# EAGLE design light detector v2.3 (EAGLE 9.5.1)
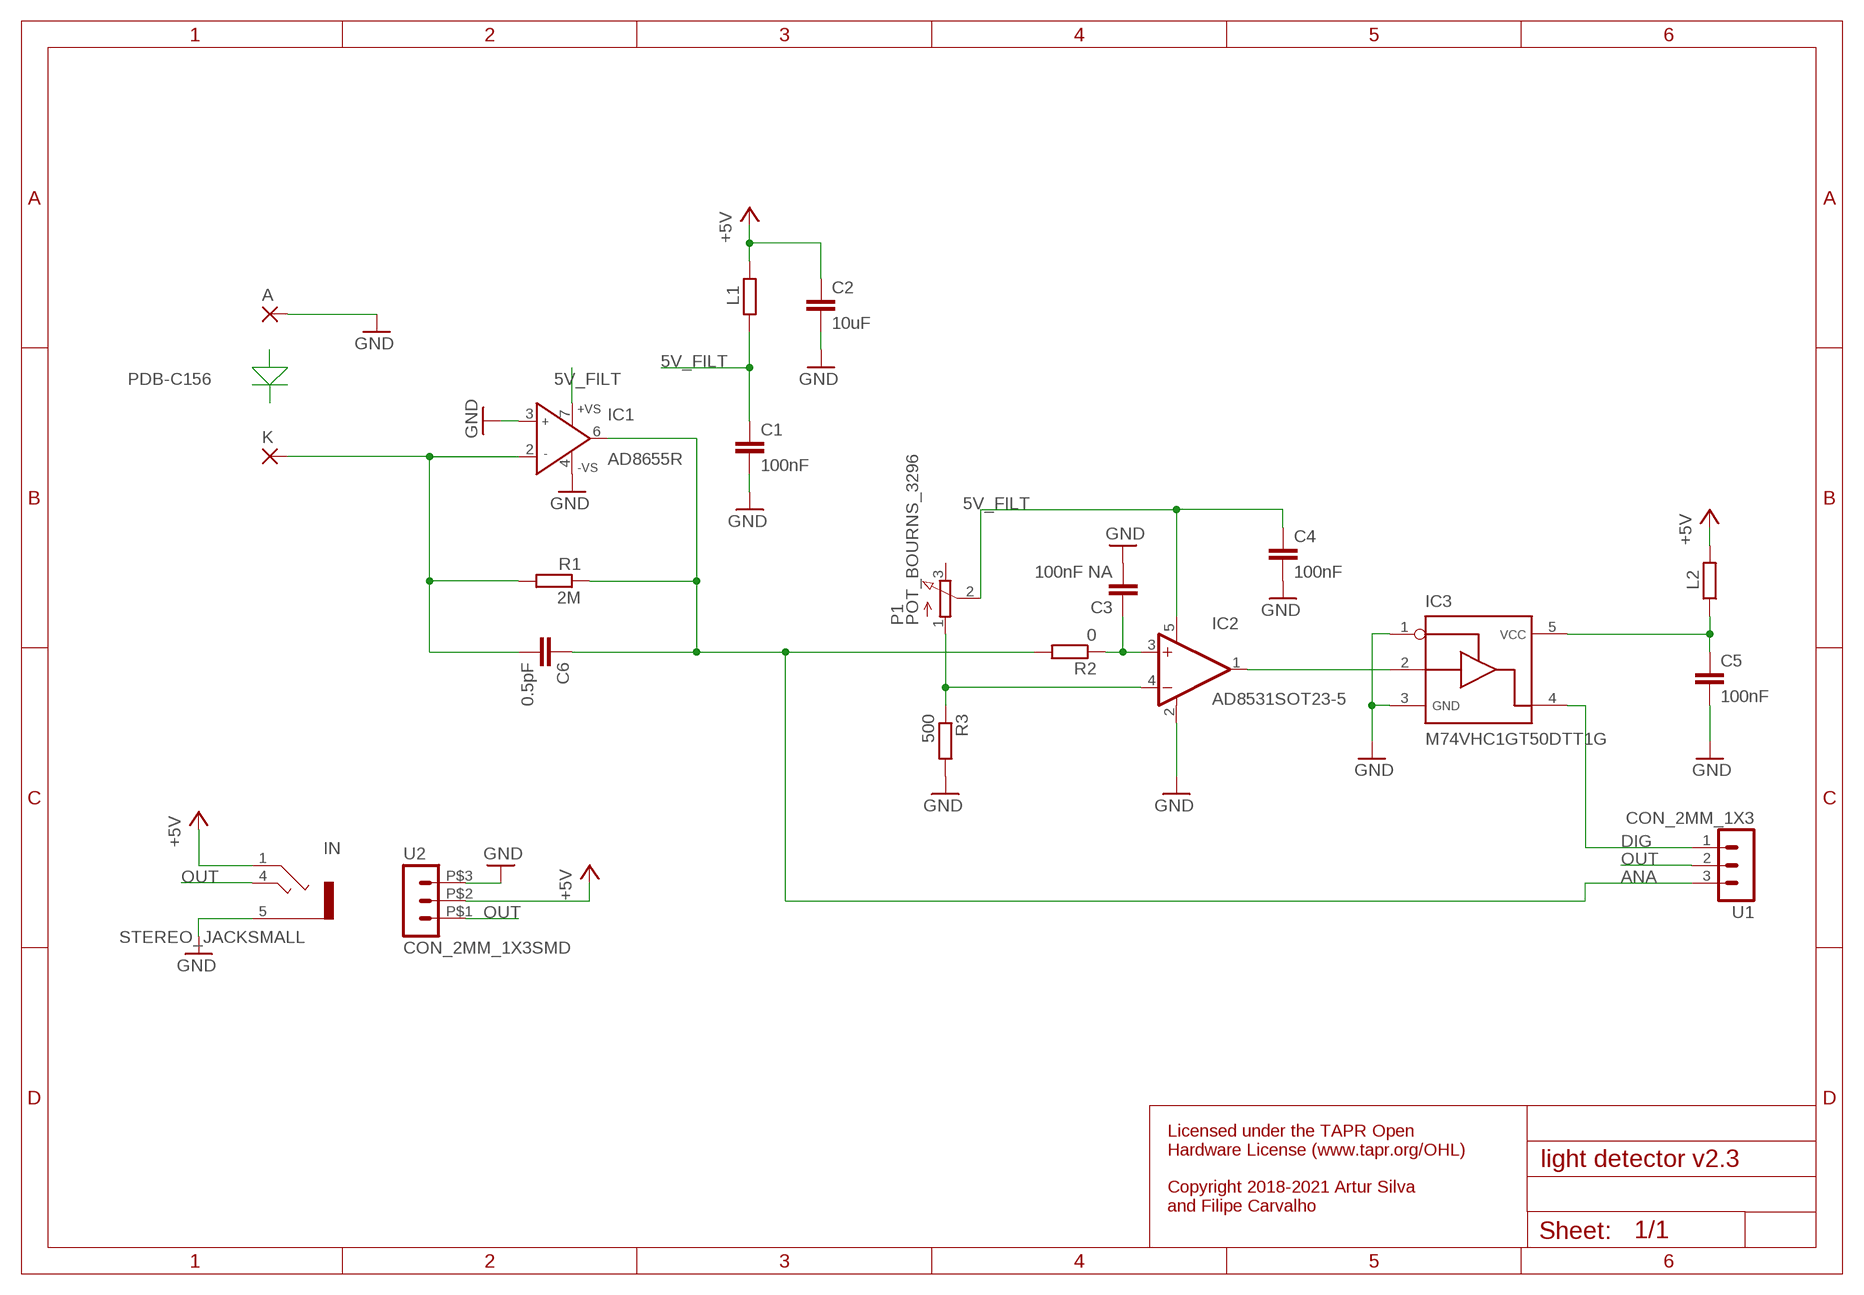
[diagram p0: schematic, sheet 1]

## Parts
A  1,6/0,8  [1,6/0,8]
C1  100nF  C-EUC0402  [C0402]
C2  10uF  C-EUC0603  [C0603]
C3  100nF NA  C-EUC0402  [C0402]
C4  100nF  C-EUC0402  [C0402]
C5  100nF  C-EUC0402  [C0402]
C6  0.5pF  C-EUC0402  [C0402]
IC1  AD8655R  [SO8]
IC2  AD8531SOT23-5  [SOT23-5]
IC3  M74VHC1GT50DTT1G  SN74LVC1G125  [SOT23-5]
IN  STEREO_JACKSMALL  [35RASMT2BHNTRX_]
K  1,6/0,8  [1,6/0,8]
L1  1k@100M  R-EU_R0402  [R0402]
L2  1k@100M  R-EU_R0402  [R0402]
P1  POT_BOURNS_3296  [POT_BOURNS_3296P]
R1  2M  R-EU_R0402  [R0402]
R2  0  R-EU_R0402  [R0402]
R3  500  R-EU_R0402  [R0402]
U1  CON_2MM_1X3  [CON_2MM_1X3]
U2  CON_2MM_1X3SMD  [CON_2MM_1X3_SMD]

## Nets
5V_FILT: C1.1 C4.1 IC1.7(+VS) IC2.5(V+) L1.2 P1.2(S)
+5V: C2.1 IN.1 L1.1 L2.2 U2.P$2
ANA: C6.1 IC1.6(OUT) R1.1 R2.2 U1.3
DIG: IC3.4 U1.1
GND: A.1(P) C1.2 C2.2 C3.2 C4.2 C5.2 IC1.3(IN+) IC1.4(-VS) IC2.2(V-) IC3.1 IC3.3 IN.5 R3.2 U2.P$3
IN2: IC2.4(-IN) P1.1(A) R3.1
N$2: C6.2 IC1.2(IN-) K.1(P) R1.2
N$6: C3.1 IC2.3(+IN) R2.1
N$7: IC2.1(OUT) IC3.2
N$8: C5.1 IC3.5 L2.1
OUT: IN.4 U1.2 U2.P$1
Unconnected: P1.3(E)

## Notes on the sheet
- PDB-C156
- Licensed under the TAPR Open 
  Hardware License (www.tapr.org/OHL)
  
  Copyright 2018-2021 Artur Silva 
  and Filipe Carvalho

## Library data of the parts
A K = wirepad:1,6/0,8: THROUGH-HOLE PAD
C1-C6 = rcl:C-EU: CAPACITOR, European symbol
IC1 = analog-devices:AD8655: Low Noise, Precision CMOS Amplifier Source: http://www.analog.com/static/imported-files/data_sheets/AD8655_8656.pdf; MF: ALTERA CORPORATION; MPN: AD8655ARMZ-REEL; OC_FARNELL: 1078267; OC_NEWARK: 59K7050
IC2 = CNP-ics 1:AD8531
IC3 = My_library 0v2:SN74LVC1G125
IN = CNP-connectors:STEREO_JACK
L1 L2 R1-R3 = rcl:R-EU_: RESISTOR, European symbol
P1 = CNP-miscellaneous:POT_BOURNS_3296
U1 U2 = CNP-connectors:CON_2MM_1X3

## Board
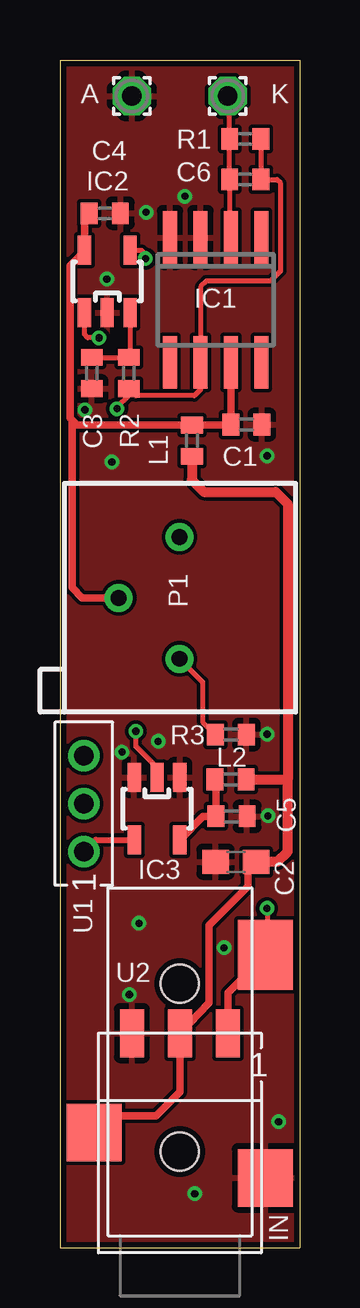
[diagram p1: board, top side]
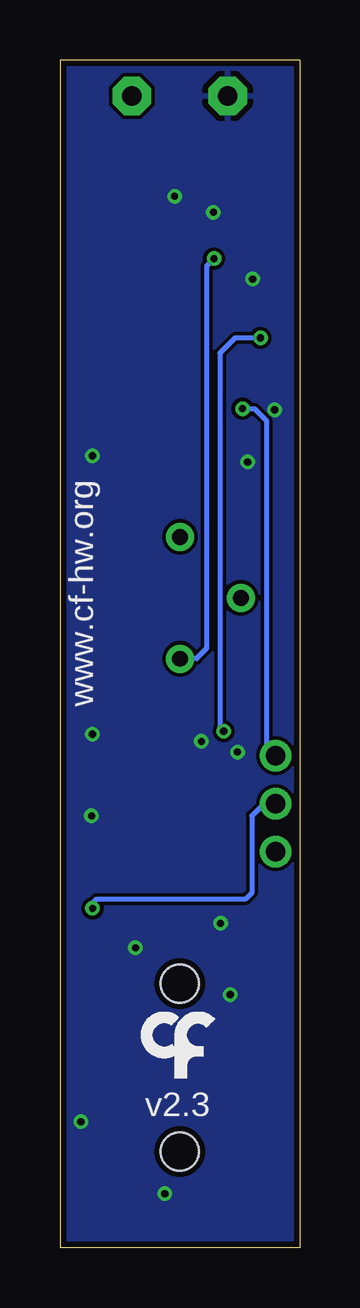
[diagram p2: board, bottom side, seen from below]

Size 10 x 49.5 mm. Coordinates in mm from the lower left corner, seen from the top.
Outline: 0,49.5 10,49.5 10,0 0,0 0,49.5
Copper layers (1*16): Top 0.035mm / dielectric 1.5mm / Bottom 0.035mm
Design rules "SeeedStudio_2layer_DRU_no_angle_20140221 *": minimum track width 6mil, minimum drill 0.3mm, track to track 6mil, track to pad 6mil, pad to pad 6mil, via to via 6mil, smd to smd 0mil, copper to edge 10mil, drill to drill 10mil, minimum pad ring 10mil, minimum via ring 6mil, stop-mask expansion 2mil, vias tented up to drill 100mil, thermal gap 10mil

### Footprints (pad centres in the part's own frame; a part is rotated, then mirrored left to right if it is on the bottom)
1,6/0,8 = drill 0.813 pad 1.6 octagon: 1 0,0
C0402 = smd 0.7 x 0.9: 1 -0.65,0; 2 0.65,0
C0603 = smd 1.1 x 1: 1 -0.85,0; 2 0.85,0
SO8 = smd 0.6 x 2.2: 1 -1.905,-2.6; 2 -0.635,-2.6; 3 0.635,-2.6; 4 1.905,-2.6; 5 1.905,2.6; 6 0.635,2.6; 7 -0.635,2.6; 8 -1.905,2.6
SOT23-5 = smd 0.55 x 1.2: 1 -0.95,-1.3; 2 0,-1.3; 3 0.95,-1.3; 4 0.95,1.3; 5 -0.95,1.3
35RASMT2BHNTRX_ = smd 2.4 x 2.3: 1 0.8,3.575; 5 -1.1,-3.575 | smd 2.9 x 2.3: 4 8.2,-3.575 | hole 1.6: 0,0; 7,0
R0402 = smd 0.7 x 0.9: 1 -0.65,0; 2 0.65,0
POT_BOURNS_3296P = drill 0.66: 1 -2.54,4.85; 2 0,7.39; 3 2.54,4.85
CON_2MM_1X3 = drill 0.8 pad 1.2: 1 -2,0; 2 0,0; 3 2,0
CON_2MM_1X3_SMD = smd 1 x 2: P$1 -2,-5.08; P$2 0,-5.08; P$3 2,-5.08

### Placement (x,y rotation side)
A  3,48 0 top
C1  7.78,34.3 0 top
C2  7.34,16.08 180 top
C3  1.33,36.45 270 top
C4  1.87,43.11 0 top
C5  7.16,17.97 0 top
C6  7.73,44.52 180 top
IC1  6.5,39.5 180 top
IC2  1.97,40.27 0 top
IC3  4.05,18.29 180 top
IN  5,4 90 top
K  7,48 0 top
L1  5.51,33.63 90 top
L2  7.12,19.51 0 top
P1  9.84,27.08 90 top
R1  7.73,46.21 180 top
R2  2.88,36.45 270 top
R3  7.13,21.38 0 top
U1  1,18.5 90 top
U2  5,3.85 180 top
U$2  [LOGO_8]  5.67,8.88 0 bottom

### Tracks (layer width: path | path; a pad name or v marks a point on that pad's centre or on a via)
5V_FILT
  Top 0.203: IC1.7 7.13,36.92 7.13,36.93
  Top 0.305: 7.13,36.93 C1.1 7.11,34.28 L1.2 0.72,34.28 0.5,34.5 | 0.5,34.5 0.5,27.51 0.94,27.07 P1.2 | 0.5,34.5 0.42,34.58 0.42,40.92 0.97,41.47 IC2.5 1.02,42.81 1.27,43.06 C4.1
+5V
  Top 0.305: C2.1 7.84,15.73 7.84,15.05 6.21,13.42 6.21,10.2 U2.P$2 5,6.5 4,5.5 2,5.5 1.43,4.92 IN.1
  Top 0.406: L1.1 5.51,31.99 6,31.5 9,31.5 9.5,31 9.5,19.51 | L2.2 9.5,19.51 | C2.1 9.08,16.08 9.5,16.5 9.5,19.51
ANA  (via drill 0.3)
  Top 0.203: R1.1 C6.1 9.05,44.52 9.21,44.36 9.21,40.71 8.78,40.28 6.11,40.28 5.87,40.04 IC1.6 5.87,35.77 5.61,35.51 3.17,35.51 R2.2 2.88,35.52 2.38,35.02 v2.38,34.97
  Bottom 0.203: v2.38,34.97 1.88,34.97 1.38,34.47 1.38,20.88 U1.3
DIG
  Top 0.254: U1.1 1.49,16.99 IC3.4
GND  (via drill 0.3 pad 0.6)
  other vias: 3.3,13.52 8.65,33 5.22,43.82 3.6,43.16 8.64,21.4 2.59,20.66 4.1,21.1 8.68,17.99 9.12,5.24 2.17,32.74 1.04,34.92 1.96,40.37 5.62,2.24 2.9,10.55 6.85,12.49
  pour Bottom: 10,0 0,0 0,49.5 10,49.5
  pour Top: 10,0 0,0 0,49.5 10,49.5
IN2  (via drill 0.3 pad 0.6)
  Top 0.203: IC2.4 3.36,41.57 3.41,41.56 3.57,41.39 v3.57,41.22 | P1.1 5.96,23.57 5.96,21.91 R3.1
  Bottom 0.203: v3.57,41.22 3.88,40.91 3.88,24.97 4.3,24.55 P1.1
N$2
  Top 0.203: IC1.2 7.08,42.16 C6.2 R1.2 7.08,47.92 K.1
N$6
  Top 0.203: C3.1 R2.1 2.92,37.15 IC2.3
N$7  (via drill 0.3 pad 0.6)
  Top 0.203: v1.64,37.92 v1.63,37.92 1.17,37.92 1.02,38.06 IC2.1 | v3.17,21.52 3.17,20.9 4.05,20.02 IC3.2
  Bottom 0.203: v1.64,37.92 2.69,37.92 3.33,37.27 3.33,21.68 v3.17,21.52
N$8
  Top 0.305: IC3.5 5.98,17.97 C5.1 6.51,19.47 L2.1
OUT  (via drill 0.3)
  Top 0.203: v8.64,14.14 8.65,14.12 8.65,12.28 IN.4
  Top 0.305: U2.P$1 7,10.62 8.65,12.28
  Bottom 0.203: U1.2 1.5,18.5 2,18 2,14.78 2.27,14.51 8.49,14.51 8.64,14.36 v8.64,14.14

### Text on the board
bPlace: www.cf-hw.org | v2.3